# EAGLE design RFID_H2_v2 (EAGLE 9.6.1)
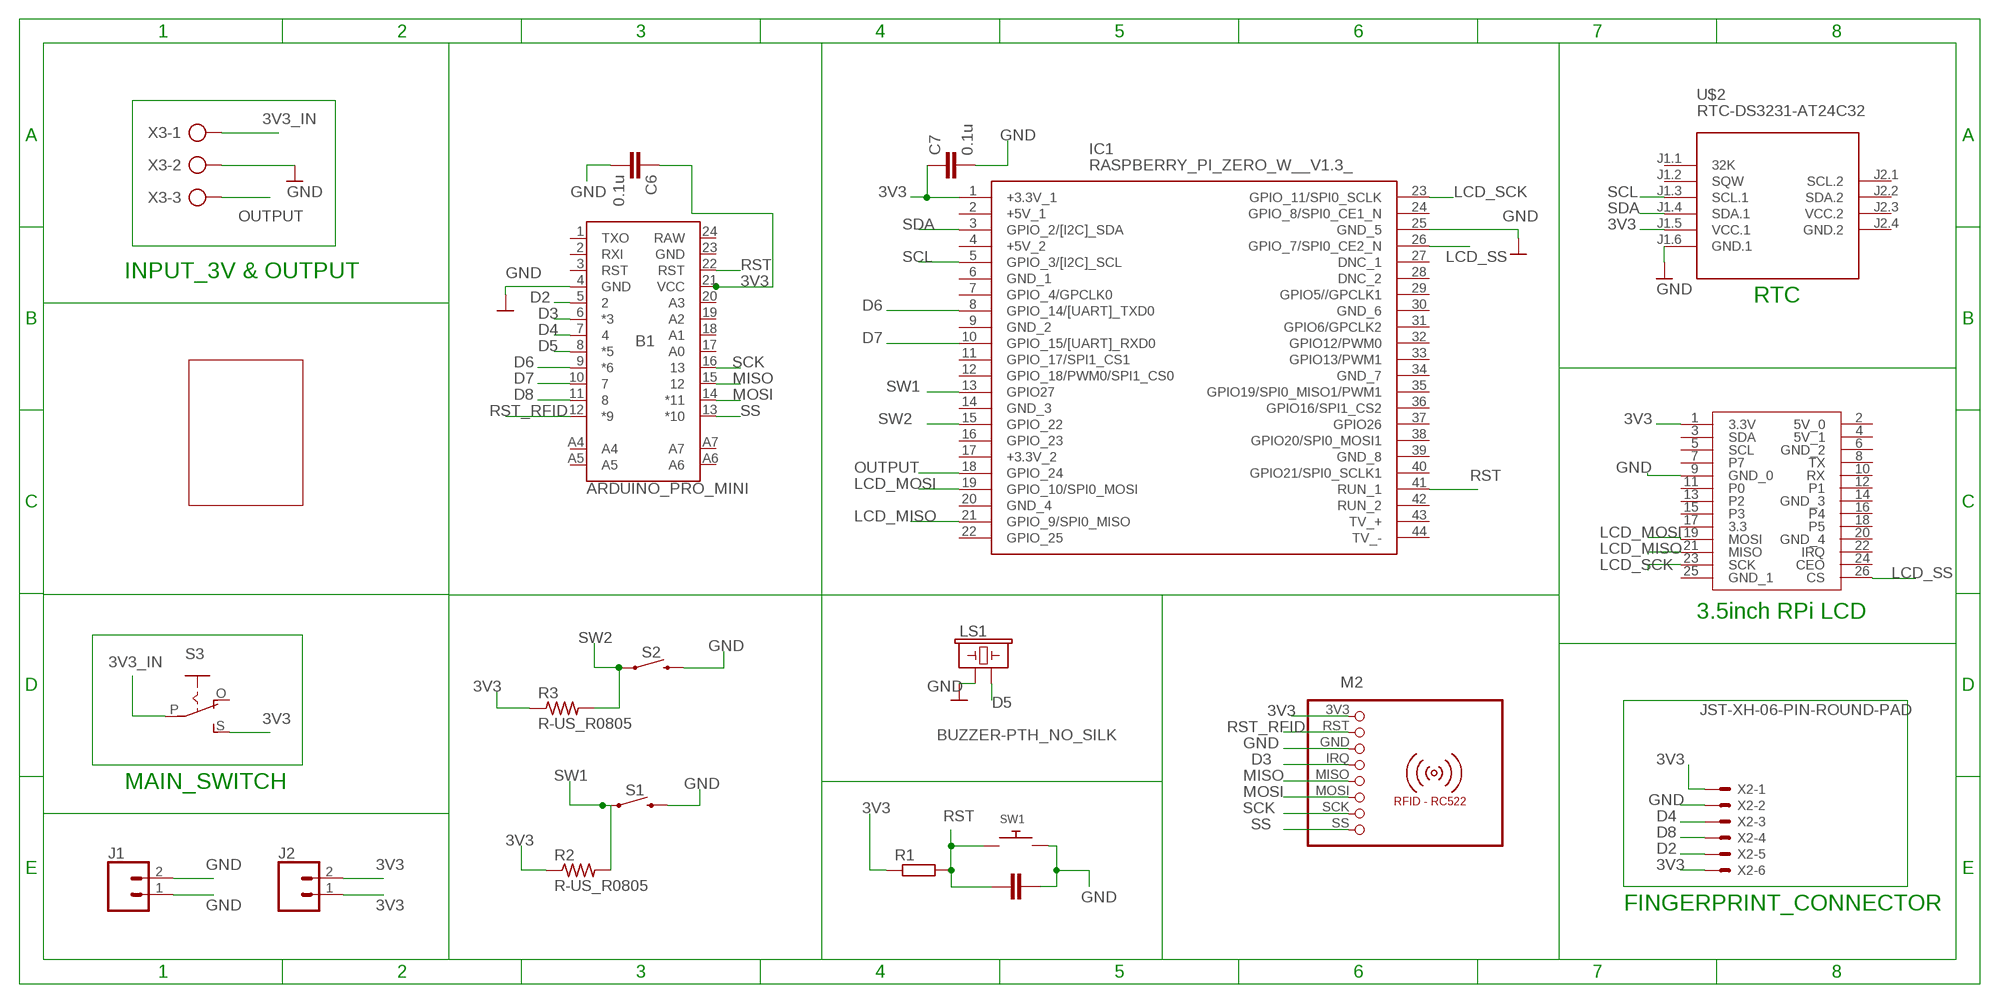
[diagram p0: schematic, sheet 1]

## Parts
B1  ARDUINO_PRO_MINI  [ARDUINO_PRO_MINI]
C5  10n  C-EUC0805K  [C0805K]
C6  0.1u  C-EUC0805  [C0805]
C7  0.1u  C-EUC0805  [C0805]
IC1  RASPBERRY_PI_ZERO_W__V1.3_  [RASPBERRYPIZEROWV13]
J1  CONN_02  [1X02]
J2  CONN_02  [1X02]
LS1  BUZZER-PTH_NO_SILK  [BUZZER-12MM-NS]
M2  RFID-RC522  [RFID-RC522]
R1  R-EU_0204/5  [0204/5]
R2  R-US_R0805  [R0805]
R3  R-US_R0805  [R0805]
S1  MOMENTARY-SWITCH-SPST-PTH-12MM  [TACTILE_SWITCH_PTH_12MM]
S2  MOMENTARY-SWITCH-SPST-PTH-12MM  [TACTILE_SWITCH_PTH_12MM]
S3  EG1218S  [EG1218]
SW1  SWITCH_PUSHBUTTONEVQ-PE  [TACT_PANA-EVQ]
U$2  RTC-DS3231-AT24C32  [RTC-DS3231-AT24C32]
U$7  3.5_INCH_TOUCHSCREEN  [FE13-2]
U$8  FINGERPRINT_BODY  [FINGERPRINT_BODY]
X2  JST-XH-06-PIN-ROUND-PAD  [JST-XH-06-PACKAGE-ROUND-PAD]
X3  AK500/3-H  [AK500/3-H]

## Nets
3V3: B1.21(VCC) C6.1 C7.1 IC1.1(+3.3V_1) J2.1 J2.2 M2.3V3 R1.1 R2.1 R3.1 S3.S U$2.J1.5(VCC.1) U$7.1(3.3V) X2.1 X2.6
3V3_IN: S3.P X3.1
D2: B1.5 X2.5
D3: B1.6(*3) M2.IRQ
D4: B1.7 X2.3
D5: B1.8(*5) LS1.-
D6: B1.9(*6) IC1.8(GPIO_14/[UART]_TXD0)
D7: B1.10 IC1.10(GPIO_15/[UART]_RXD0)
D8: B1.11 X2.4
GND: B1.4(GND) C5.1 C6.2 C7.2 IC1.25(GND_5) J1.1 J1.2 LS1.+ M2.GND S1.3 S2.3 SW1.P$2 U$2.J1.6(GND.1) U$7.9(GND_0) X2.2 X3.2
LCD_MISO: IC1.21(GPIO_9/SPI0_MISO) U$7.21(MISO)
LCD_MOSI: IC1.19(GPIO_10/SPI0_MOSI) U$7.19(MOSI)
LCD_SCK: IC1.23(GPIO_11/SPI0_SCLK) U$7.23(SCK)
LCD_SS: IC1.26(GPIO_7/SPI0_CE2_N) U$7.26(CS)
MISO: B1.15 M2.MISO
MOSI: B1.14(*11) M2.MOSI
OUTPUT: IC1.18(GPIO_24) X3.3
RST: B1.22(RST) C5.2 IC1.41(RUN_1) R1.2 SW1.P$1
RST_RFID: B1.12(*9) M2.RST
SCK: B1.16 M2.SCK
SCL: IC1.5(GPIO_3/[I2C]_SCL) U$2.J1.3(SCL.1)
SDA: IC1.3(GPIO_2/[I2C]_SDA) U$2.J1.4(SDA.1)
SS: B1.13(*10) M2.SS
SW1: IC1.13(GPIO27) R2.2 S1.1
SW2: IC1.15(GPIO_22) R3.2 S2.1
Unconnected: B1.1(TXO) B1.2(RXI) B1.3(RST) B1.17(A0) B1.18(A1) B1.19(A2) B1.20(A3) B1.A4 B1.A5 B1.A6 B1.A7 IC1.2(+5V_1) IC1.4(+5V_2) IC1.6(GND_1) IC1.7(GPIO_4/GPCLK0) IC1.9(GND_2) IC1.11(GPIO_17/SPI1_CS1) IC1.12(GPIO_18/PWM0/SPI1_CS0) IC1.14(GND_3) IC1.16(GPIO_23) IC1.17(+3.3V_2) IC1.20(GND_4) IC1.22(GPIO_25) IC1.24(GPIO_8/SPI0_CE1_N) IC1.27(DNC_1) IC1.28(DNC_2) IC1.29(GPIO5//GPCLK1) IC1.30(GND_6) IC1.31(GPIO6/GPCLK2) IC1.32(GPIO12/PWM0) IC1.33(GPIO13/PWM1) IC1.34(GND_7) IC1.35(GPIO19/SPI0_MISO1/PWM1) IC1.36(GPIO16/SPI1_CS2) IC1.37(GPIO26) IC1.38(GPIO20/SPI0_MOSI1) IC1.39(GND_8) IC1.40(GPIO21/SPI0_SCLK1) IC1.42(RUN_2) IC1.43(TV_+) IC1.44(TV_-) S3.O U$2.J1.1(32K) U$2.J1.2(SQW) U$2.J2.1(SCL.2) U$2.J2.2(SDA.2) U$7.2(5V_0) U$7.3(SDA) U$7.4(5V_1) U$7.5(SCL) U$7.6(GND_2) U$7.7 U$7.8(TX) U$7.10(RX) U$7.11(P0) U$7.12(P1) U$7.13(P2) U$7.14(GND_3) U$7.15(P3) U$7.16(P4) U$7.17(3.3) U$7.18(P5) U$7.20(GND_4) U$7.22(IRQ) U$7.24(CEO) U$7.25(GND_1)

## Notes on the sheet
- INPUT_3V & OUTPUT
- RTC
- 3.5inch RPi LCD
- MAIN_SWITCH
- FINGERPRINT_CONNECTOR

## Power pins joined to a net without a drawn wire
GND: B1.23(GND)
GND.2: U$2.J2.4(GND.2)
RAW: B1.24(RAW)
VCC.2: U$2.J2.3(VCC.2)

## Library data of the parts
B1 = SparkFun-Boards:ARDUINO_PRO_MINI: SparkFun Pro Mini Pro Mini compatible footprint. Dimensions: 0.7 x 1.3" PCB Thickness: 0.8mm SparkFun Products: 3.3V/8MHz <https://www.sparkfun.com/products/11114> 5V/16MHz <https://www.sparkfun.com/products/11113>
C5-C7 = rcl:C-EU: CAPACITOR, European symbol; SPICEPREFIX: C
IC1 = Raspberry_Pi_Zero_W__v1.3_:RASPBERRY_PI_ZERO_W__V1.3_: Raspberry Pi Zero W (v1.3) Single-board Computers Source: Datasheet <https://cdn.sparkfun.com/assets/learn_tutorials/6/7/6/PiZero_1.pdf>; DESCRIPTION: Raspberry Pi Zero W (v1.3) Single-board Computers; HEIGHT: mm; MANUFACTURER_NAME: RASPBERRY-PI; MANUFACTURER_PART_NUMBER: Raspberry Pi Zero W (v1.3)
J1 J2 = SparkFun-Connectors:CONN_02: Multi connection point. Often used as Generic Header-pin footprint for 0.1 inch spaced/style header connections On any of the 0.1 inch spaced packages, you can populate with these: Break Away Headers - Straight <https://www.sparkfun.com/products/116> (PRT-00116) Break Away Male Headers - Right Angle <https://www.sparkfun.com/products/553> (PRT-00553) Female Headers <https://www.sparkfun.com/products/115> (PRT-00115) Break Away Headers - Machine Pin <https://www.sparkfun.com/products/117> (PRT-00117) Break Away Female Headers - Swiss Machine Pin <https://www.sparkfun.com/products/743> (PRT-00743) For SCREWTERMINALS and SPRING TERMINALS visit here: Screw Terimnals on SparkFun.com <https://www.sparkfun.com/search/results?term=Screw+Terminals> (5mm/3.5mm/2.54mm spacing) This device is also useful as a general connection point to wire up your design to another part of your project. Our various solder wires solder well into these plated through hole pads. Hook-Up Wire - Assortment (Stranded, 22 AWG) <https://www.sparkfun.com/products/11375> (PRT-11375) Hook-Up Wire - Assortment (Solid Core, 22 AWG) <https://www.sparkfun.com/products/11367> (PRT-11367) View the entire wire category on our website here <https://www.sparkfun.com/categories/141> Special notes: Molex polarized connector foot print use with: PRT-08233 with associated crimp pins and housings. 2.54_SCREWTERM for use with PRT-10571. 3.5mm Screw Terminal footprints for PRT-08084 5mm Screw Terminal footprints for use with PRT-08432
LS1 = SparkFun-Electromechanical:BUZZER: Buzzer Small round buzzers that operate around the audible 2kHz range. You can use these as speakers to create simple music or user interfaces. Variant Overview: PTH - Mini Speaker - PC Mount 12mm 2.048kHz <https://www.sparkfun.com/products/7950> PTH_KIT - Mini Speaker - PC Mount 12mm 2.048kHz <https://www.sparkfun.com/products/7950> KIT simplifies soldering by adding stop mask to one side of the pads. PTH_NO_SILK - Mini Speaker - PC Mount 12mm 2.048kHz <https://www.sparkfun.com/products/7950> No silkscreen indicator of buzzer outline. PTH_KIT_NO_SILK - Mini Speaker - PC Mount 12mm 2.048kHz <https://www.sparkfun.com/products/7950> KIT package w/o silkscreen SMD - Buzzer Audio Magnetic (CCV-084B16) SMD buzzer used on, e.g. the LilyPad Buzzer <https://www.sparkfun.com/products/8463> and RFID USB Reader <https://www.sparkfun.com/products/9963>. SMD_KIT - Buzzer Audio Magnetic (CCV-084B16) SMD Buzzer with elongated pins to make soldering easier. Used on the SparkFun Simon Says - Surface Mount Soldering Kit <https://www.sparkfun.com/products/10935>.; PROD_ID: COMP-08253; SF_SKU: COM-07950
M2 = mfrc522-module:RFID-RC522: RFID-RC522 MFRC-522 based breakout board
R1 = resistor:R-EU_: RESISTOR, European symbol
R2 R3 = audio amplifier example:R-US_: RESISTOR, American symbol
S1 S2 = SparkFun-Switches:MOMENTARY-SWITCH-SPST: Momentary Switch (Pushbutton) - SPST Normally-open (NO) SPST momentary switches (buttons, pushbuttons). Variants PTH-12MM - 12mm square, through-hole Momentary Pushbutton Switch - 12mm Square <https://www.sparkfun.com/products/9190> (COM-09190) PTH-6.0MM, PTH-6.0MM-KIT - 6.0mm square, through-hole Mini Pushbutton Switch <https://www.sparkfun.com/products/97> (COM-00097) KIT package intended for soldering kit's - only one side of pads' copper is exposed. PTH-RIGHT-ANGLE-KIT - Right-angle, through-hole Right Angle Tactile Button <https://www.sparkfun.com/products/10791> - Used on SparkFun BigTime Watch Kit <https://www.sparkfun.com/products/11734> SMD-12MM - 12mm square, surface-mount Tactile Button - SMD (12mm) <https://www.sparkfun.com/products/12993> (COM-12993) Used on SparkFun PicoBoard <https://www.sparkfun.com/products/11888> SMD-4.5MM - 4.5mm Square Trackball Switch Used on SparkFun Blackberry Trackballer Breakout <https://www.sparkfun.com/products/13169> SMD-4.6MMX2.8MM - 4.60mm x 2.80mm, surface mount Used on SparkFun SAMD21 Mini Breakout <https://www.sparkfun.com/products/13664> SMD-5.2MM, SMD-5.2-REDUNDANT - 5.2mm square, surface-mount Mini Pushbutton Switch - SMD <https://www.sparkfun.com/products/8720> (COM-08720) Used on Arduino Pro Mini <https://www.sparkfun.com/products/11114> REDUNDANT package connects both switch circuits together SMD-6.0X3.5MM - 6.0 x 3.5mm, surface mount Momentary Reset Switch SMD <https://www.sparkfun.com/products/8229> (COM-08229) SMD-6.2MM-TALL - 6.2mm square, surface mount Tactile Button - SMD (6mm) <https://www.sparkfun.com/products/12992> Used on SparkFun Digital Sandbox <https://www.sparkfun.com/products/12651> SMD-RIGHT-ANGLE - Right-angle, surface mount Used on SparkFun Block for Intel® Edison - Arduino <https://www.sparkfun.com/products/13036>; PROD_ID: SWCH-09185; SF_SKU: COM-09190
S3 = adafruit:EG1218: SLIDING SWITCH 0.1" spacing through hole, vertical SPDT slide switch http://www.ladyada.net/library/pcb/eaglelibrary.html
SW1 = adafruit:SWITCH_PUSHBUTTON: Buttons SOFTTOUCHSMD_SJ - Soft touch temporary push button (Super Junk Akihabara) Compatible with SKPMANE010 [Mouser: 688-SKPMAN] C&K_KSS = Digikey: KSS221GLFS
U$2 = diy-modules:RTC-DS3231-AT24C32: RTC Module with Battery and EEPROM based on DS3231 and AT24C32 chips Tutorial can be found here: https://edwardmallon.wordpress.com/2014/05/21/using-a-cheap-3-ds3231-rtc-at24c32-eeprom-from-ebay/ Click here to find device on ebay.com <http://www.ebay.com/sch/DS3231+AT24C32+module>
U$7 = 3.5_inch_touchscreen:3.5_INCH_TOUCHSCREEN
U$8 = FingerPrint_Body:FINGERPRINT_BODY
X2 = Rembrandt Electronics - JST XH Connectors v1-0:JST-XH-06-PIN: JST XH Connector 2 Pin Wire to board connector. Pitch: 2,54 mm, (0.100") Number of pins: 6 Created by Rembrandt Electronics www.rembrandtelectronics.com
X3 = con-ptr500:AK500/3-H: CONNECTOR Aug. 2004 / PTR Meßtechnik: Die Bezeichnung der Serie AK505 wurde geändert. Es handelt sich hierbei um AK500 in horizontaler Ausführung.; OC_FARNELL: unknown; OC_NEWARK: unknown

## Board
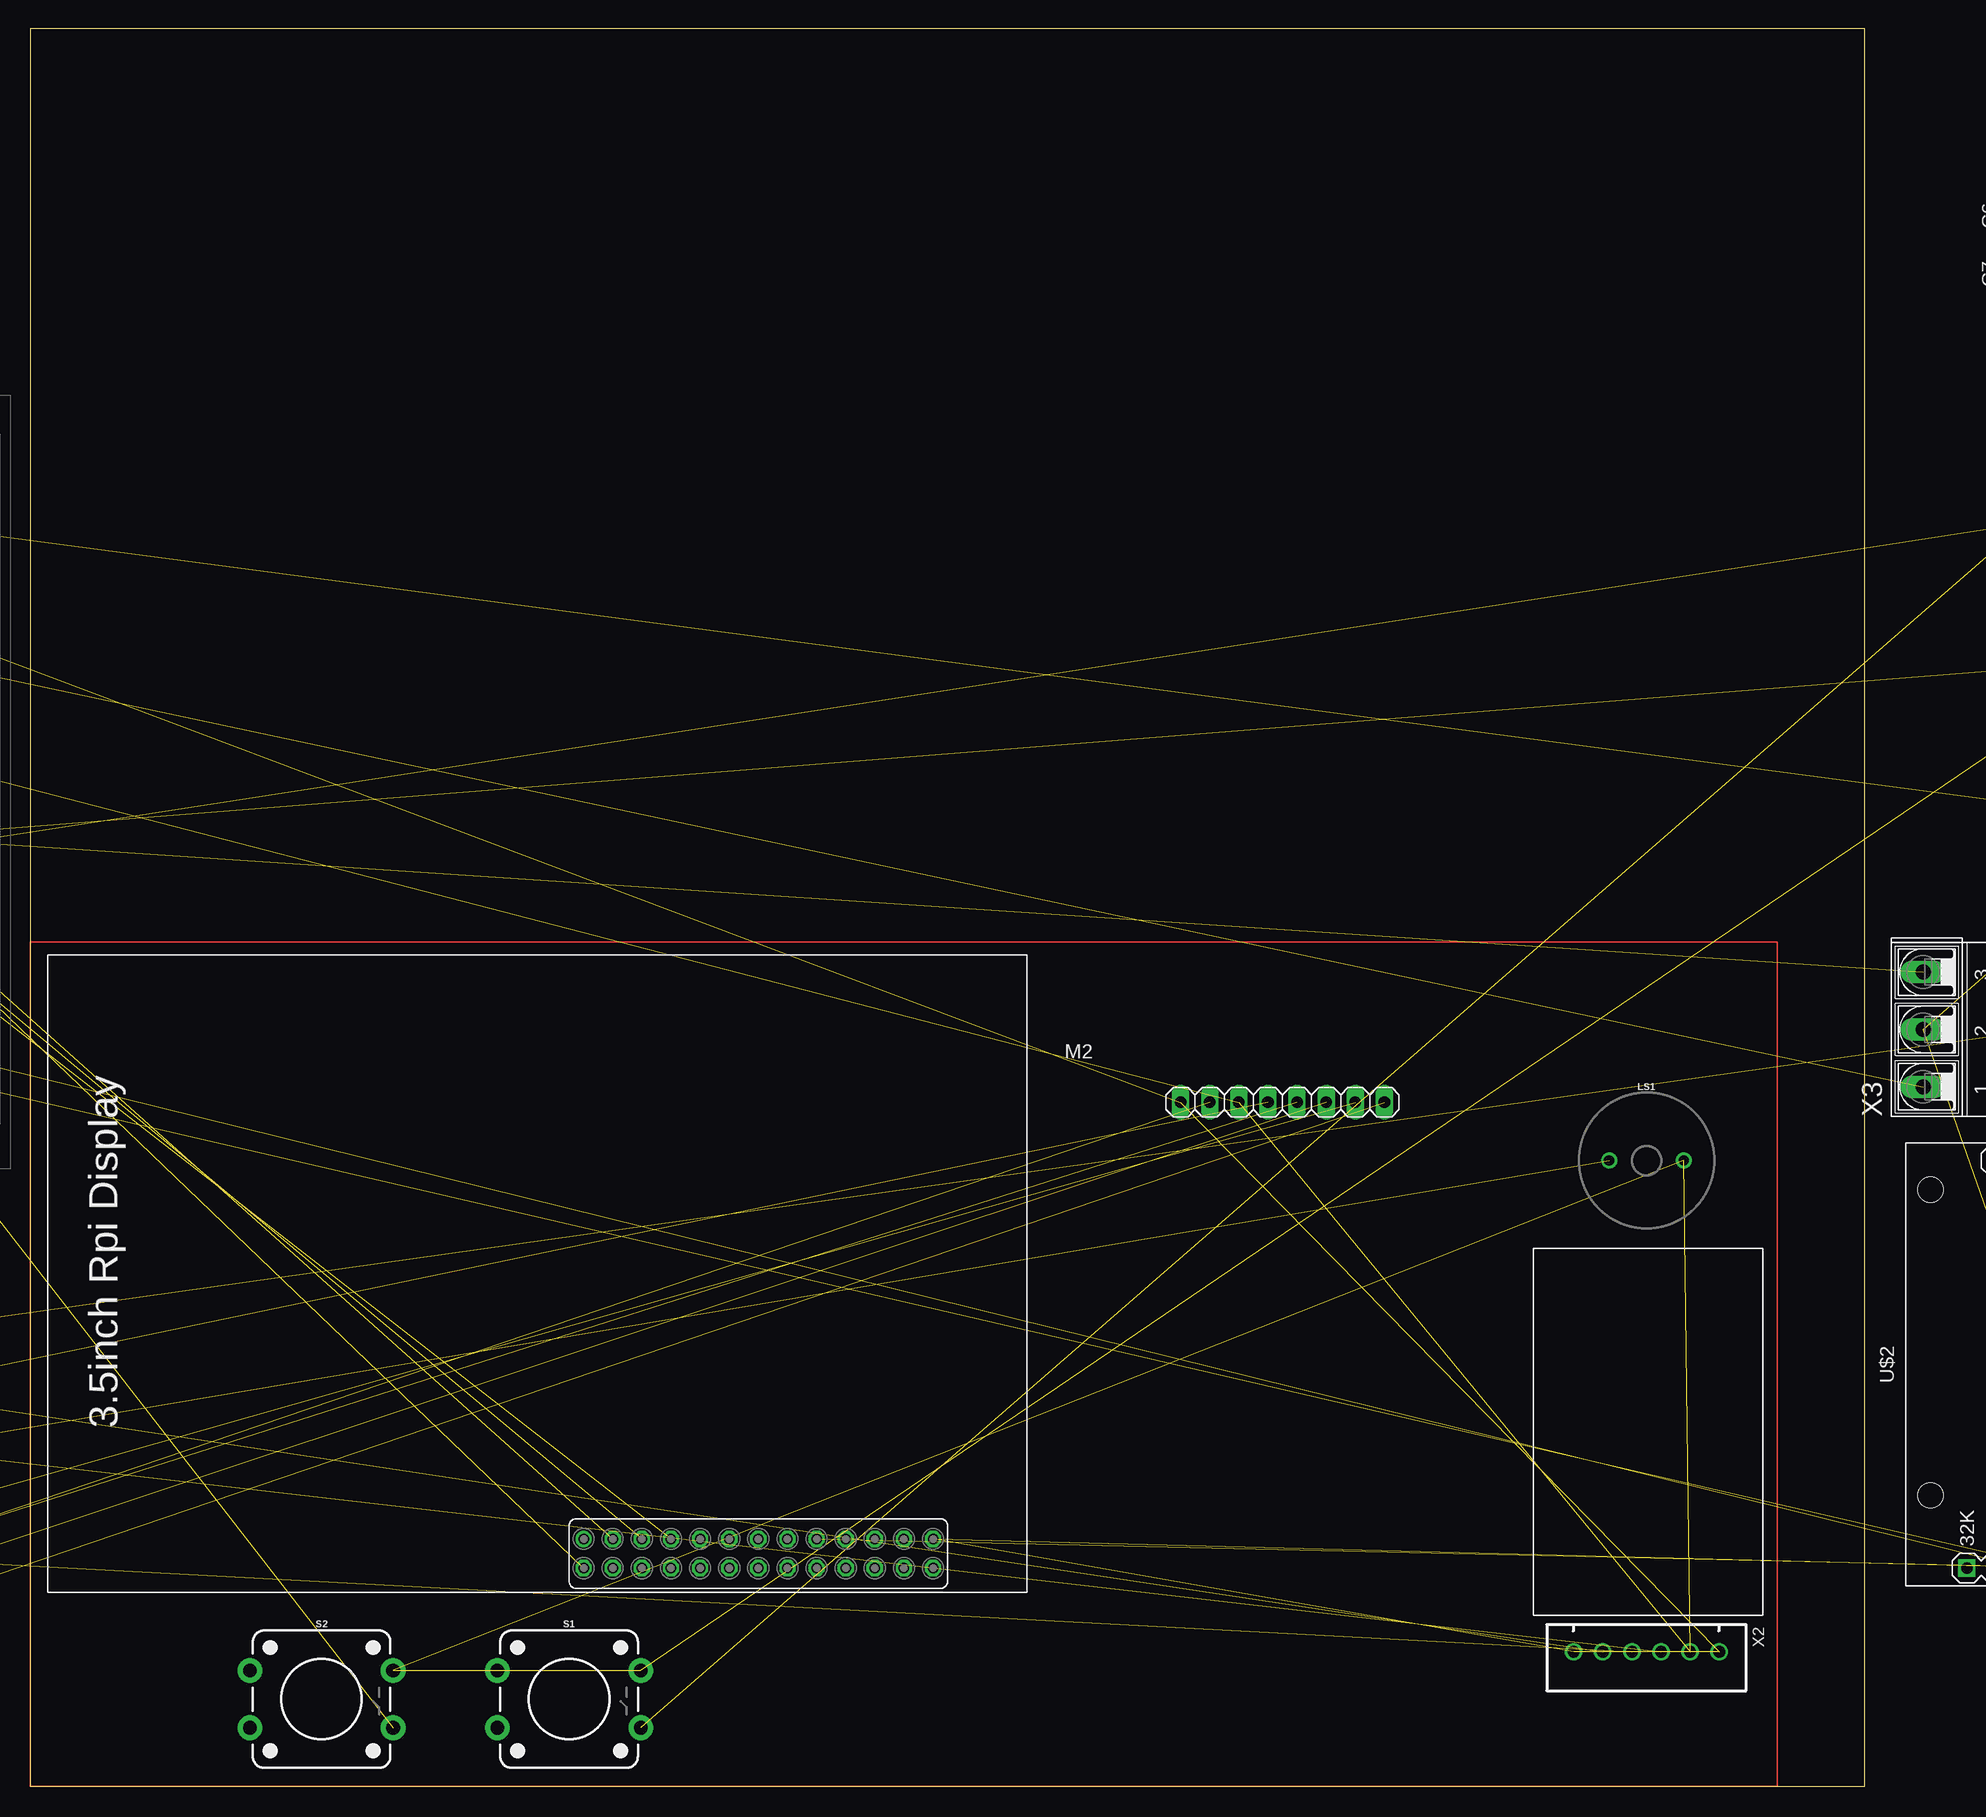
[diagram p1: board, top side]

Size 160 x 153.34 mm. Coordinates in mm from the lower left corner, seen from the top.
Outline: 0,0 160,0 160,153.34 0,153.34 0,0
Copper layers (1*16): Top 0.035mm / dielectric 1.5mm / Bottom 0.035mm
Design rules "default": minimum track width 6mil, minimum drill 0.35mm, track to track 6mil, track to pad 6mil, pad to pad 6mil, via to via 6mil, smd to smd 6mil, copper to edge 40mil, drill to drill 6mil, minimum pad ring 10mil, minimum via ring 8mil, stop-mask expansion 4mil, vias tented up to drill 0mil, thermal gap 10mil

### Footprints (pad centres in the part's own frame; a part is rotated, then mirrored left to right if it is on the bottom)
ARDUINO_PRO_MINI = drill 1.016 pad 1.88: 1 -7.62,12.7; 2 -7.62,10.16; 3 -7.62,7.62; 4 -7.62,5.08; 5 -7.62,2.54; 6 -7.62,0; 7 -7.62,-2.54; 8 -7.62,-5.08; 9 -7.62,-7.62; 10 -7.62,-10.16; 11 -7.62,-12.7; 12 -7.62,-15.24; 13 7.62,-15.24; 14 7.62,-12.7; 15 7.62,-10.16; 16 7.62,-7.62; 17 7.62,-5.08; 18 7.62,-2.54; 19 7.62,0; 20 7.62,2.54; 21 7.62,5.08; 22 7.62,7.62; 23 7.62,10.16; 24 7.62,12.7; A4 4.763,1.429; A5 4.763,3.969; A6 4.763,-9.049; A7 4.763,-6.509; BLK -6.35,15.24; GND -3.81,15.24; GRN 6.35,15.24; RXI 1.27,15.24; TXO 3.81,15.24; VCC -1.27,15.24
C0805K = smd 1.3 x 1.6: 1 -1,0; 2 1,0
C0805 = smd 1.3 x 1.5: 1 -0.95,0; 2 0.95,0
RASPBERRYPIZEROWV13 = drill 1.11 pad 1.665 square: 1 -23.885,9.92; 41 24.375,7.38; 43 21.835,4.84 | drill 1.11 pad 1.665: 2 -23.885,12.46; 3 -21.345,9.92; 4 -21.345,12.46; 5 -18.805,9.92; 6 -18.805,12.46; 7 -16.265,9.92; 8 -16.265,12.46; 9 -13.725,9.92; 10 -13.725,12.46; 11 -11.185,9.92; 12 -11.185,12.46; 13 -8.645,9.92; 14 -8.645,12.46; 15 -6.105,9.92; 16 -6.105,12.46; 17 -3.565,9.92; 18 -3.565,12.46; 19 -1.025,9.92; 20 -1.025,12.46; 21 1.515,9.92; 22 1.515,12.46; 23 4.055,9.92; 24 4.055,12.46; 25 6.595,9.92; 26 6.595,12.46; 27 9.135,9.92; 28 9.135,12.46; 29 11.675,9.92; 30 11.675,12.46; 31 14.215,9.92; 32 14.215,12.46; 33 16.755,9.92; 34 16.755,12.46; 35 19.295,9.92; 36 19.295,12.46; 37 21.835,9.92; 38 21.835,12.46; 39 24.375,9.92; 40 24.375,12.46; 42 21.835,7.38; 44 24.375,4.84 | hole 2.8: -28.755,11.5; -28.755,-11.5; 29.245,-11.5; 29.245,11.5
1X02 = drill 1.016 pad 1.88: 1 0,0; 2 2.54,0
BUZZER-12MM-NS = drill 0.9: + 3.25,0; - -3.25,0
RFID-RC522 = drill 1.016 long: 3V3 -8.89,0; GND -3.81,0; IRQ -1.27,0; MISO 1.27,0; MOSI 3.81,0; RST -6.35,0; SCK 6.35,0; SS 8.89,0
0204/5 = drill 0.813 octagon: 1 -2.54,0; 2 2.54,0
R0805 = smd 1.1 x 1.4: 1 -1,0; 2 1,0
TACTILE_SWITCH_PTH_12MM = drill 1.2 pad 2.159: 1 6.25,-2.5; 2 -6.25,-2.5; 3 6.25,2.5; 4 -6.25,2.5
EG1218 = drill 0.9 pad 1.676: O -2.54,0; P 0,0; S 2.54,0
TACT_PANA-EVQ = drill 1.3 pad 2.54: P$1 -3.25,0; P$2 3.25,0
RTC-DS3231-AT24C32 = drill 1 square: J1.1 -17.78,6.35; J2.1 17.78,3.81 | drill 1: J1.2 -17.78,3.81; J1.3 -17.78,1.27; J1.4 -17.78,-1.27; J1.5 -17.78,-3.81; J1.6 -17.78,-6.35; J2.2 17.78,1.27; J2.3 17.78,-1.27; J2.4 17.78,-3.81 | hole 2.2: -11.43,-9.525; -11.43,9.525; 15.24,9.525
FE13-2 = drill 0.914 octagon: 1 15.24,1.27; 2 15.24,-1.27; 3 12.7,1.27; 4 12.7,-1.27; 5 10.16,1.27; 6 10.16,-1.27; 7 7.62,1.27; 8 7.62,-1.27; 9 5.08,1.27; 10 5.08,-1.27; 11 2.54,1.27; 12 2.54,-1.27; 13 0,1.27; 14 0,-1.27; 15 -2.54,1.27; 16 -2.54,-1.27; 17 -5.08,1.27; 18 -5.08,-1.27; 19 -7.62,1.27; 20 -7.62,-1.27; 21 -10.16,1.27; 22 -10.16,-1.27; 23 -12.7,1.27; 24 -12.7,-1.27; 26 -15.24,-1.27 | drill 0.914: 25 -15.24,1.27
JST-XH-06-PACKAGE-ROUND-PAD = drill 1.016: 1 -6.35,0; 2 -3.81,0; 3 -1.27,0; 4 1.27,0; 5 3.81,0; 6 6.35,0
AK500/3-H = drill 1.321 long: 1 -5.004,0; 2 0,0; 3 5.004,0

### Placement (x,y rotation side)
B1  -12.7,33.02 0 top  (outside the outline)
C5  173.99,81.28 90 top  (outside the outline)
C6  172.72,137.16 90 top  (outside the outline)
C7  172.72,132.08 90 top  (outside the outline)
IC1  -17.78,87.63 90 top  (outside the outline)
J1  175.26,74.93 90 top  (outside the outline)
J2  175.26,68.58 90 top  (outside the outline)
LS1  140.97,54.61 0 top
M2  109.22,59.69 0 top
R1  175.26,63.5 90 top  (outside the outline)
R2  173.99,109.22 90 top  (outside the outline)
R3  173.99,96.52 90 top  (outside the outline)
S1  46.99,7.62 0 top
S2  25.4,7.62 0 top
S3  -7.62,97.79 90 top  (outside the outline)
SW1  173.99,88.9 90 top  (outside the outline)
U$2  175.26,36.83 90 top  (outside the outline)
U$7  63.5,20.32 0 top
U$8  131.11,14.92 0 top
X2  140.97,11.75 180 top
X3  165.1,66.04 90 top  (outside the outline)

### Tracks (layer width: path | path; a pad name or v marks a point on that pad's centre or on a via)
3V3  (14 unrouted)
3V3_IN  (1 unrouted)
D2  (1 unrouted)
D3  (1 unrouted)
D4  (1 unrouted)
D5  (1 unrouted)
D6  (1 unrouted)
D7  (1 unrouted)
D8  (1 unrouted)
GND  (16 unrouted)
LCD_MISO  (1 unrouted)
LCD_MOSI  (1 unrouted)
LCD_SCK  (1 unrouted)
LCD_SS  (1 unrouted)
MISO  (1 unrouted)
MOSI  (1 unrouted)
N$1
  Top 0.152: 0,0 0,73.66 152.4,73.66 152.4,0
N$2
  Top 0.152: 152.4,0 0,0
OUTPUT  (1 unrouted)
RST  (4 unrouted)
RST_RFID  (1 unrouted)
SCK  (1 unrouted)
SCL  (1 unrouted)
SDA  (1 unrouted)
SS  (1 unrouted)
SW1  (2 unrouted)
SW2  (2 unrouted)